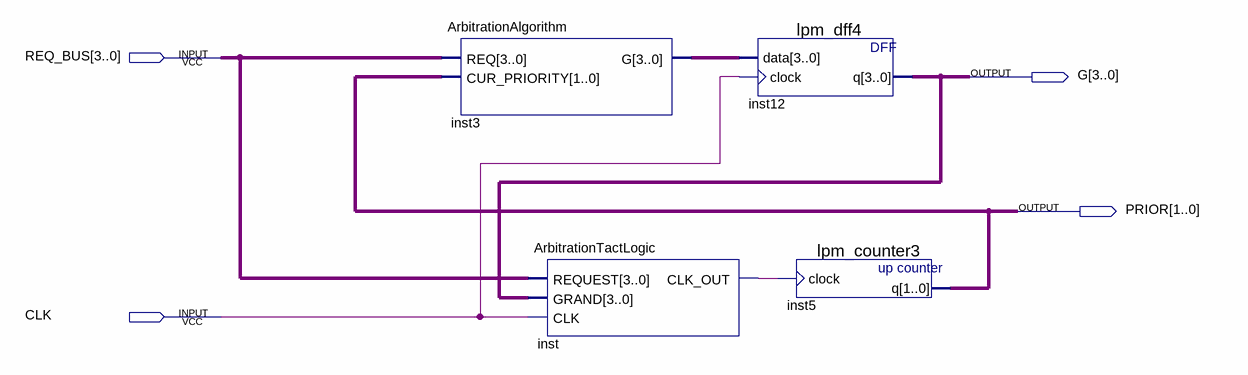
[diagram p0: schematic sheet]
// Quartus schematic Arbitration.bdf as structural Verilog: 4 symbols, 4 pins
module Arbitration (
  input  [3:0] REQ_BUS,
  input  CLK,
  output [3:0] G,
  output [1:0] PRIOR
);

  wire inst_clk_out;
  wire [3:0] inst3_g;

  ArbitrationAlgorithm inst3 (.REQ(REQ_BUS), .CUR_PRIORITY(PRIOR), .G(inst3_g));
  ArbitrationTactLogic inst (.REQUEST(REQ_BUS), .GRAND(G), .CLK(CLK), .CLK_OUT(inst_clk_out));
  lpm_dff4 inst12 (.data(inst3_g), .clock(CLK), .q(G));
  lpm_counter3 inst5 (.clock(inst_clk_out), .q(PRIOR));
endmodule
